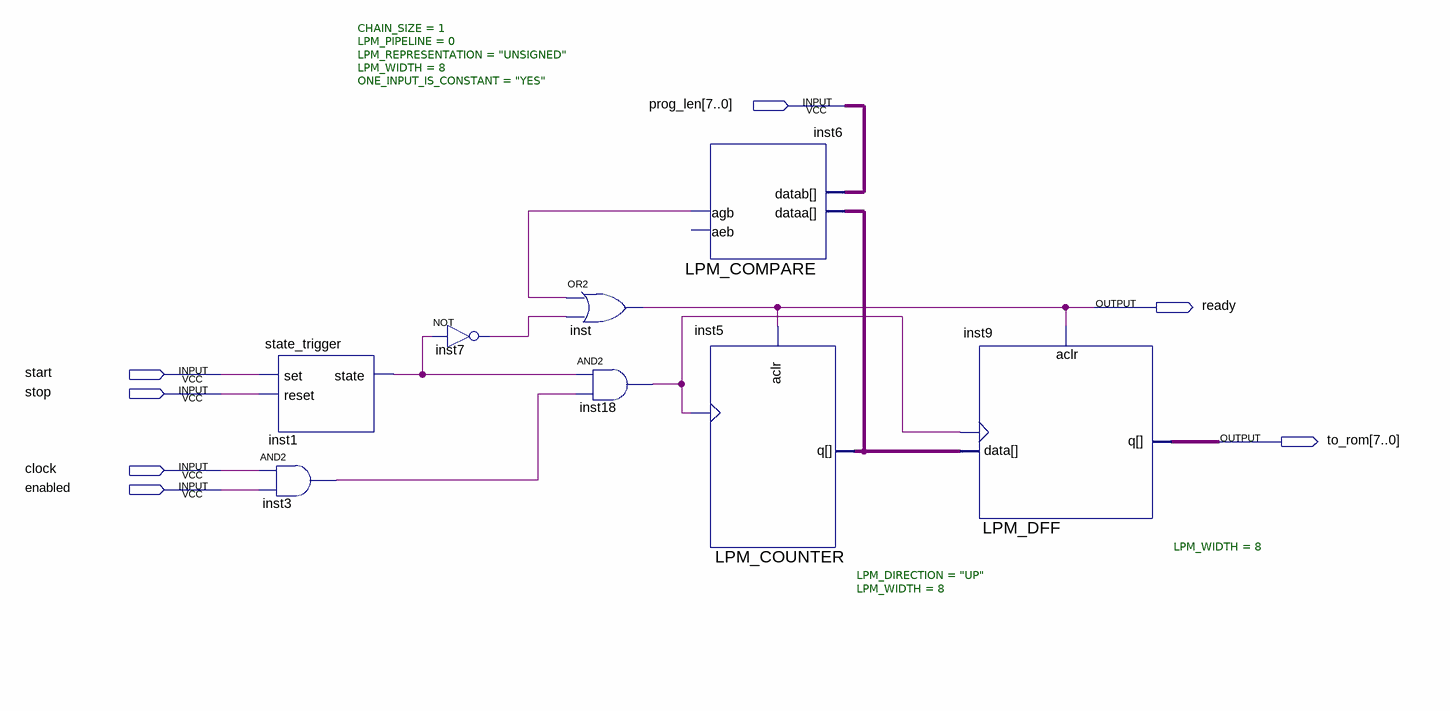
[diagram p0: schematic sheet]
// Quartus schematic unstoppable_iterator.bdf as structural Verilog: 8 symbols, 7 pins
module unstoppable_iterator (
  input  [7:0] prog_len,
  input  start,
  input  stop,
  input  clock,
  input  enabled,
  output ready,
  output [7:0] to_rom
);

  wire inst1_state, inst3_out, inst6_agb, inst7_out, inst18_out;
  wire [7:0] inst5_q;

  state_trigger inst1 (.set(start), .reset(stop), .state(inst1_state));
  and inst3 (inst3_out, clock, enabled);
  not inst7 (inst7_out, inst1_state);
  or inst (ready, inst6_agb, inst7_out);
  and inst18 (inst18_out, inst1_state, inst3_out);
  LPM_COMPARE #(.CHAIN_SIZE(1), .LPM_PIPELINE(0), .LPM_REPRESENTATION("UNSIGNED"), .LPM_WIDTH(8), .ONE_INPUT_IS_CONSTANT("YES")) inst6 (
    .dataa(inst5_q), .datab(prog_len), .agb(inst6_agb));  // open: aeb
  LPM_COUNTER #(.LPM_DIRECTION("UP"), .LPM_WIDTH(8)) inst5 (.clock(inst18_out), .aclr(ready), .q(inst5_q));
  LPM_DFF #(.LPM_WIDTH(8)) inst9 (.clock(inst18_out), .data(inst5_q), .aclr(ready), .q(to_rom));
endmodule
